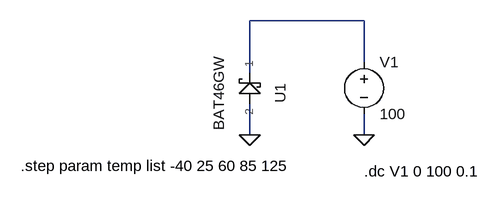
[diagram p0: schematic Gate_diode_validation.asc]
Gate_diode_validation.asc, the LTspice schematic file:
Version 4.1
SHEET 1 880 680
WIRE 304 48 128 48
WIRE 304 112 304 48
WIRE 128 128 128 48
WIRE 128 224 128 176
WIRE 304 224 304 192
FLAG 128 224 0
FLAG 304 224 0
SYMBOL BAT46GW 128 160 R90
SYMATTR InstName U1
SYMBOL voltage 304 96 R0
WINDOW 123 0 0 Left 0
WINDOW 39 0 0 Left 0
SYMATTR InstName V1
SYMATTR Value 100
TEXT -224 272 Left 2 !.step param temp list -40 25 60 85 125
TEXT 304 280 Left 2 !.dc V1 0 100 0.1

The netlist it stands for:
* Gate_diode_validation.asc
X§U1 N001 0 BAT46GW  ; pins 1 2
V1 N001 0 100
.step param temp list -40 25 60 85 125
.dc V1 0 100 0.1
.lib BAT46GW.lib
.backanno
.end